# EAGLE design Logic_Level_Converter (EAGLE 6.5.0)
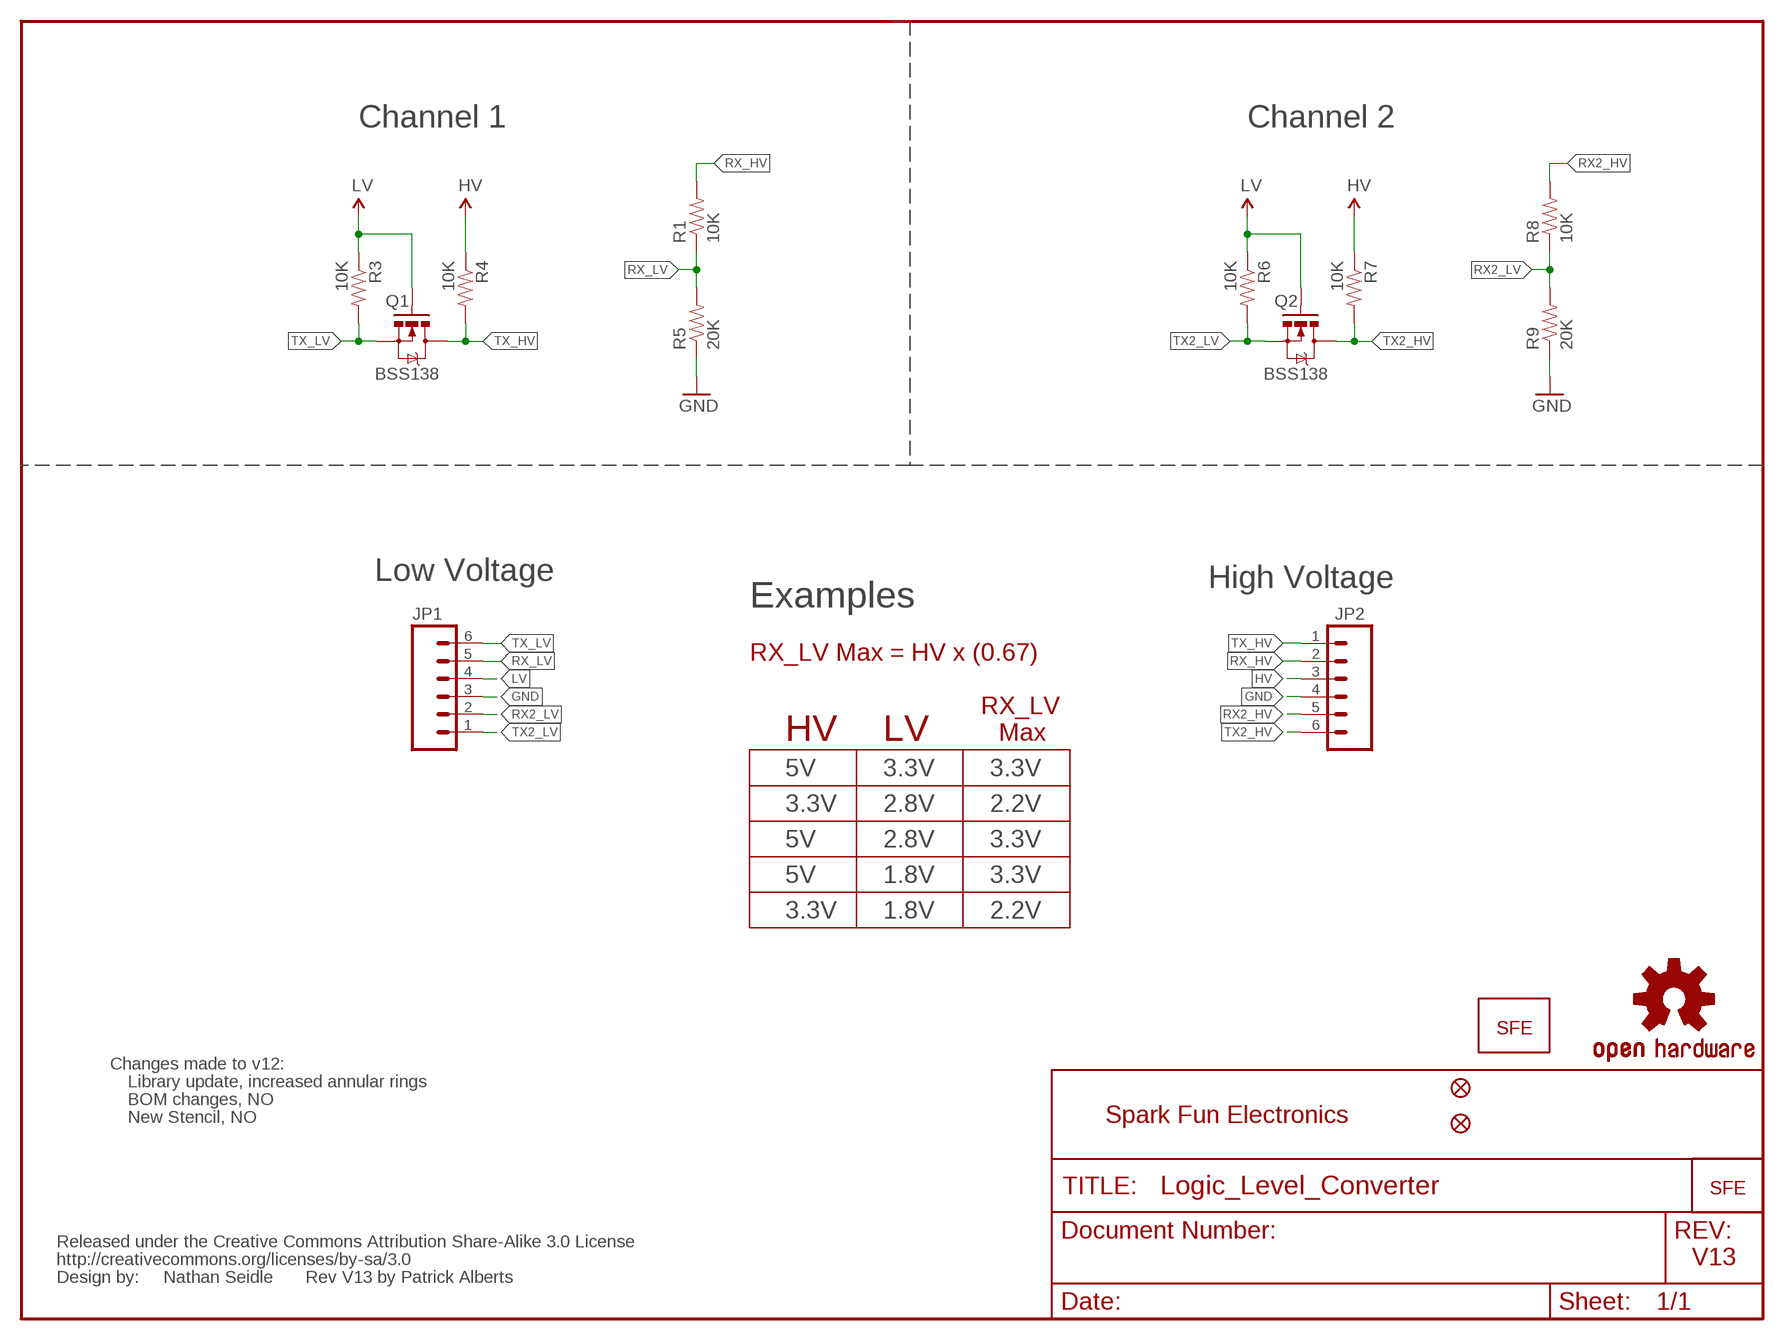
[diagram p0: schematic, sheet 1]

## Parts
CC_TEXT1  CREATIVE_COMMONS  [CREATIVE_COMMONS]
JP1  M06SIP  [1X06]
JP2  M06SIP  [1X06]
JP3  FIDUCIALUFIDUCIAL  [MICRO-FIDUCIAL]
JP4  FIDUCIALUFIDUCIAL  [MICRO-FIDUCIAL]
JP5  LOGO-SFENW2  [SFE-NEW-WEB]
Q1  BSS138  MOSFET-NCHANNELSMD  [SOT23-3]
Q2  BSS138  MOSFET-NCHANNELSMD  [SOT23-3]
R1  10K  RESISTOR0603-RES  [0603-RES]
R3  10K  RESISTOR0603-RES  [0603-RES]
R4  10K  RESISTOR0603-RES  [0603-RES]
R5  20K  RESISTOR0603-RES  [0603-RES]
R6  10K  RESISTOR0603-RES  [0603-RES]
R7  10K  RESISTOR0603-RES  [0603-RES]
R8  10K  RESISTOR0603-RES  [0603-RES]
R9  20K  RESISTOR0603-RES  [0603-RES]
U$1  LOGO-SFESK  [SFE-LOGO-FLAME]
U$2  OSHW-LOGOS  [OSHW-LOGO-S]

## Nets
GND: JP1.3 JP2.4 R5.1 R9.1
HV: JP2.3 R4.1 R7.1
LV: JP1.4 Q1.1(G) Q2.1(G) R3.1 R6.1
RX2_HV: JP2.5 R8.2
RX2_LV: JP1.2 R8.1 R9.2
RX_HV: JP2.2 R1.2
RX_LV: JP1.5 R1.1 R5.2
TX2_HV: JP2.6 Q2.3(D) R7.2
TX2_LV: JP1.1 Q2.2(S) R6.2
TX_HV: JP2.1 Q1.3(D) R4.2
TX_LV: JP1.6 Q1.2(S) R3.2

## Notes on the sheet
- Channel 1 | Channel 2
- Low Voltage | High Voltage
- Examples
- RX_LV Max = HV x (0.67)
- RX_LV
- HV | LV | Max
- 5V | 3.3V | 3.3V
- 3.3V | 2.8V | 2.2V
- 5V | 2.8V | 3.3V
- 5V | 1.8V | 3.3V
- 3.3V | 1.8V | 2.2V
- Changes made to v12:
- Library update, increased annular rings
- BOM changes, NO
- New Stencil, NO | Spark Fun Electronics
- V13
- Nathan Seidle | Rev V13 by Patrick Alberts

## Library data of the parts
CC_TEXT1 = SparkFun-Aesthetics:CREATIVE_COMMONS: Creative Commons License summary
JP1 JP2 = SparkFun:M06: Header 6 Standard 6-pin 0.1" header. Use with straight break away headers (SKU : PRT-00116), right angle break away headers (PRT-00553), swiss pins (PRT-00743), machine pins (PRT-00117), and female headers (PRT-00115). Molex polarized connector foot print use with SKU : PRT-08094 with associated crimp pins and housings. NOTES ON THE VARIANTS LOCK and LOCK_LONGPADS... This footprint was designed to help hold the alignment of a through-hole component (i.e. 6-pin header) while soldering it into place. You may notice that each hole has been shifted either up or down by 0.005 of an inch from it's more standard position (which is a perfectly straight line). This slight alteration caused the pins (the squares in the middle) to touch the edges of the holes. Because they are alternating, it causes a "brace" to hold the component in place. 0.005 has proven to be the perfect amount of "off-center" position when using our standard breakaway headers. Although looks a little odd when you look at the bare footprint, once you have a header in there, the alteration is very hard to notice. Also, if you push a header all the way into place, it is covered up entirely on the bottom side. This idea of altering the position of holes to aid alignment will be further integrated into the Sparkfun Library for other footprints. It can help hold any component with 3 or more connection pins.
JP3 JP4 = SparkFun:FIDUCIAL: Fiducial Alignment Points Various fiducial points for machine vision alignment.
JP5 = SparkFun-Aesthetics:LOGO-SFE: Spark Fun Electronics PCB Logo This is the standard Spark Fun Electronics PCB logo.
Q1 Q2 = SparkFun:MOSFET-NCHANNEL
R1 R3-R9 = SparkFun:RESISTOR: Resistor Basic schematic elements and footprints for 0603, 1206, and PTH resistors.
U$1 = SparkFun:LOGO-SFE: Spark Fun Electronics PCB Logo This is the standard Spark Fun Electronics PCB logo.
U$2 = SparkFun-Aesthetics:OSHW-LOGO: Open Source Hardware Logo This logo indicates the piece of hardware it is found on incorporates a OSHW license and/or adheres to the definition of open source hardware found here: http://freedomdefined.org/OSHW

## Board
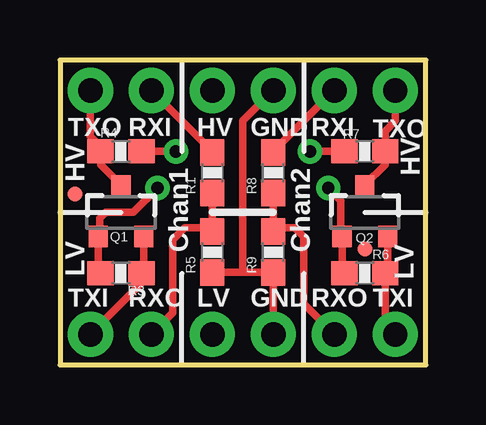
[diagram p1: board, top side]
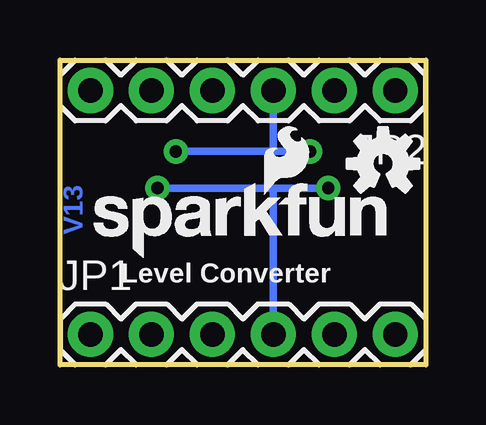
[diagram p2: board, bottom side, seen from below]

Size 15.24 x 12.7 mm. Coordinates in mm from the lower left corner, seen from the top.
Outline: 0,0 15.24,0 15.24,12.7 0,12.7 0,0
Copper layers (1*16): Top 0.035mm / dielectric 1.5mm / Bottom 0.035mm
Design rules "SparkFun *": minimum track width 7mil, minimum drill 15mil, track to track 8mil, track to pad 8mil, pad to pad 8mil, via to via 8mil, smd to smd 8mil, copper to edge 8mil, drill to drill 8mil, minimum pad ring 12mil, minimum via ring 10mil, stop-mask expansion 4mil, vias tented up to drill 20mil, thermal gap 10mil

### Footprints (pad centres in the part's own frame; a part is rotated, then mirrored left to right if it is on the bottom)
1X06 = drill 1.016 pad 1.88: 1 0,0; 2 2.54,0; 3 5.08,0; 4 7.62,0; 5 10.16,0; 6 12.7,0
MICRO-FIDUCIAL = smd 0.635 x 0.635: 1 0,0
SOT23-3 = smd 0.8 x 0.9: 1 -0.95,-1; 2 0.95,-1; 3 0,1.1
0603-RES = smd 1.1 x 1: 1 -0.85,0; 2 0.85,0

### Placement (x,y rotation side)
CC_TEXT1  21.59,-7.62 0 top  (outside the outline)
JP1  13.97,1.27 0 bottom
JP2  1.27,11.43 180 bottom
JP3  12.7,4.83 0 top
JP4  0.64,7.11 0 top
JP5  13.84,4.45 0 bottom
Q1  2.54,6.35 0 top
Q2  12.7,6.35 0 top
R1  6.35,8 90 top
R3  2.54,3.81 0 top
R4  2.54,8.89 180 top
R5  6.35,4.7 90 top
R6  12.7,3.81 0 top
R7  12.7,8.89 0 top
R8  8.89,8 90 top
R9  8.89,4.7 90 top
U$1  6.73,7.11 0 bottom
U$2  1.78,8.38 0 bottom

### Tracks (layer width: path | path; a pad name or v marks a point on that pad's centre or on a via)
GND
  Top 0.305: JP1.3 R9.1 7.62,3.85 | JP2.4 7.62,10.16 7.62,3.85 | R5.1 7.62,3.85
HV  (via drill 0.51)
  Top 0.305: v10.41,8.89 R7.1 | R4.1 v4.83,8.89
  Bottom 0.305: 6.35,8.89 JP2.3 | 6.35,8.89 v10.41,8.89 | v4.83,8.89 6.35,8.89
LV  (via drill 0.51)
  Top 0.305: R6.1 11.94,3.81 11.75,4 Q2.1 11.7,5.35 | R3.1 1.91,3.81 1.59,4.12 Q1.1 1.64,5.35 1.65,5.33 1.65,6.1 1.91,6.35 3.05,6.35 v4.06,7.37 | 11.7,5.35 11.68,5.33 | 11.7,5.35 11.7,6.84 v11.18,7.37
  Bottom 0.305: v4.06,7.37 6.35,7.37 | 6.35,7.37 v11.18,7.37 | 6.35,7.37 JP1.4
RX2_HV
  Top 0.305: R8.2 8.89,8.89 JP2.5
RX2_LV
  Top 0.305: R8.1 R9.2 8.89,5.71 9.78,5.71 10.16,5.33 10.16,2.54 JP1.2
RX_HV
  Top 0.305: R1.2 6.35,8.89 JP2.2
RX_LV
  Top 0.305: R1.1 R5.2 6.35,5.71 5.21,5.71 4.7,5.21 4.7,2.16 JP1.5
TX2_HV
  Top 0.305: Q2.3 12.7,7.49 13.55,8.34 R7.2 13.55,9.74 13.97,10.16 JP2.6
TX2_LV
  Top 0.305: JP1.1 13.55,1.69 R6.2 13.65,3.91 Q2.2
TX_HV
  Top 0.305: JP2.1 1.27,9.53 1.91,8.89 R4.2 1.69,8.34 2.54,7.49 Q1.3
TX_LV
  Top 0.305: Q1.2 3.49,4.12 3.17,3.81 R3.2 3.39,3.39 JP1.6

### Text on the board
Bottom: V13
tPlace: TXO | RXI | HV | GND | RXI | TXO | HV | HV | Chan1 | Chan2 | LV | LV | TXI | RXO | LV | GND | RXO | TXI
bPlace: Level Converter
tValues: Nathan Seidle | Rev V13 by Patrick Alberts